# Altium project LAD_Power.PrjPcb
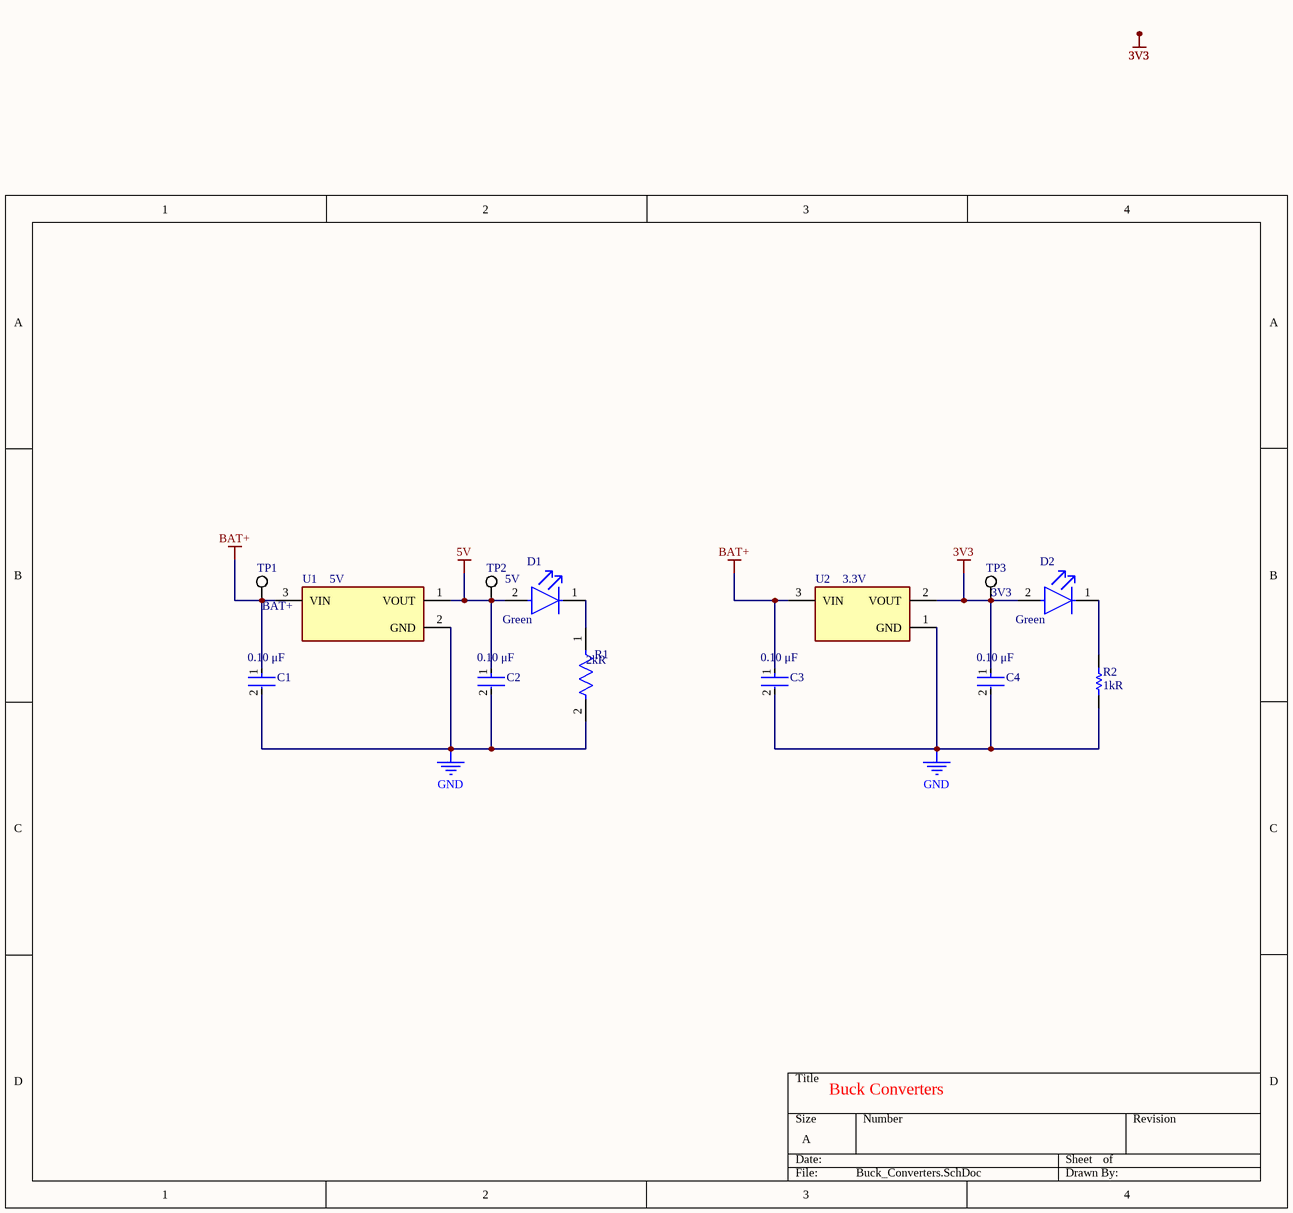
[diagram p0: Buck_Converters.SchDoc]
3 sheets, 15 parts. Net scope: global (net labels, ports and power ports of the same name join across sheets).
Board file: PCB1.PcbDoc
Sheets:
  Buck_Converters.SchDoc
  Connectors.SchDoc
  Power_Supply_no_IC.SchDoc

## Sheet Buck_Converters.SchDoc
size A; SheetNumber: 1; SheetTotal: 3

### Parts
C1  Capacitance: 0.10 μF  [FP-C0603C-CF-MFG]  (hidden comment: C0603C104K5RACTU)
C2  Capacitance: 0.10 μF  [FP-C0603C-CF-MFG]  (hidden comment: C0603C104K5RACTU)
C3  Capacitance: 0.10 μF  [FP-C0603C-CF-MFG]  (hidden comment: C0603C104K5RACTU)
C4  Capacitance: 0.10 μF  [FP-C0603C-CF-MFG]  (hidden comment: C0603C104K5RACTU)
D1  Color: Green  [FP-LTST-C190GKT-MFG]  (hidden comment: LTST-C190GKT)
D2  Color: Green  [FP-LTST-C190GKT-MFG]  (hidden comment: LTST-C190GKT)
R1  Resistance: 2kR  [FP-RG2012-IPC_A]  (hidden comment: RG2012P-202-B-T5)
R2  value 1kR  [RESC1608X55X25ML10T15]  (hidden comment: RT0603BRE071KL)
TP1  BAT+  [KSTN-5019_V]
TP2  5V  [KSTN-5019_V]
TP3  3V3  [KSTN-5019_V]
U1  Output Voltage: 5V  [FP-SOT-89-7098166-MFG]  (hidden comment: L78L05ACUTR)
U2  Output Voltage: 3.3V  [FP-SOT23-MFG]  (hidden comment: AP2120N-3.3TRG1)

### Nets
3V3: C4.1 D2.2(A) TP3.1 U2.2(VOUT)
5V: C2.1 D1.2(A) TP2.1 U1.1(VOUT)
BAT+: C1.1 C1.2 C2.2 C3.1 C3.2 C4.2 R1.2 R2.1 TP1.1 U1.2(GND) U1.3(VIN) U2.1(GND) U2.3(VIN)  [also labelled GND]
NetD1_1: D1.1(C) R1.1
NetD2_1: D2.1(C) R2.2

### Notes on the sheet
- Buck Converters

### Library data of the parts
C1-C4 = CMP-2006-03061-2: CAP CER 0.1UF 50V X7R 0603; Manufacturer: KEMET; Tolerance: 0.1; Temperature Coefficient: 30ppm/°C; Material: Ceramic; Automotive Grade: Grade 1; Value: 0.10 μF; Multilayer: Yes; Tolerance  (fill in as +-): 10%; Temperature: -55°C to +125°C; RoHS: TRUE; Temperature Range High: +125°C; Lead Free: Yes; Octopart: https://octopart.com/c0603c104k5ractu-kemet-139244; Digikey Description: CAP CER 0.1UF 50V X7R 0603; Category: Cap; Package: C0603C-CF; ComponentLink2Description: Datasheet; Temperature Range Low: -55°C; Device Class L1: Passive Components; Voltage Rating: 50 V; Automotive: Yes; Device Class L3: Ceramic Capacitors; ComponentLink2URL: https://api.kemet.com/component-edge/download/datasheet/C0603C100J5GACAUTO.pdf; Device Class L2: Capacitors; Manufacturer Part Number: C0603C104K5RACTU; Temperature Characteristic: X7R; Height: 0.87mm; Supplier: Digikey; Supplier Part Number: 399-C0603C104K5RAC7867CT-ND; Stock: 4063890; Pricing: 1=0.11, 10=0.074, 50=0.0424, 100=0.0329, 500=0.02474, 1000=0.01944 (USD); Mounting Technology: Surface Mount; Pins: 2; Dielectric Material: Ceramic; Package Shape: Rectangular; Case/Package: 0603; Terminal Finish: Nickel; Min Operating Temperature: -55°C; Max Operating Temperature: 125°C; JESD-609 Code: e3; Capacitor Type: Ceramic; Package Style: SMTMeter; Packaging: Tape and Reel; Tolerance (fill in as +-): 10%; Rated DC Voltage (URdc): 50V; Temperature Characteristics Code: X7R; Termination: Wraparound; Length: 1.6mm; Width: 0.8mm; Reach SVHC Compliant: Yes; RoHS Compliant: Yes; ComponentLink1URL: https://datasheet.ciiva.com:443/pdfs/VipMasterIC/IC/KEME/KEME-S-A0008991654/KEME-S-A0008991654-1.pdf?src-supplier=IHS+Markit; ComponentLink1Description: https://datasheet.ciiva.com:443/pdfs/VipMasterIC/IC/KEME/KEME-S-A0008991654/KEME-S-A0008991654-1.pdf?src-supplier=IHS+Markit
D1 D2 = CMP-22017-000005-2: LED GREEN CLEAR CHIP SMD; Manufacturer: Vishay Lite-On; Dominant Wavelength: 569nm; Reverse Voltage: 5V; Lens Color: Colorless; Viewing Angle: 130°; Voltage: 2V; Forward Current: 30mA; Power Dissipation: 100mW; Luminous Intensity: 6mcd; Number of LEDs: 1; Forward Voltage: 2.1V; Wavelength: 565nm; Test Current: 10mA; Shape: Rectangular; Optoelectronic Device Type: SINGLE COLOR LED; Overall Height: 0.8mm; Min Operating Temperature: -55°C; Lens Style: Clear; Mount: Surface Mount; Width: 0.8mm; Packaging: Tape and Reel; Lens Transparency: Clear; Case Code (Metric): 1608; Depth: 0.8mm; Case Code (Imperial): 0603; Case/Package: 0603; Number of Pins: 2; Max Operating Temperature: 85°C; Lead Free: Lead Free; Number of Elements: 1; Length: 1.6mm; Height: 0.8mm; Package Quantity: 1; Power Rating: 100mW; Radiation Hardening: No; Illumination Color: Green; Supplier: Digikey; Supplier Part Number: 160-1183-1-ND; Manufacturer Part Number: LTST-C190GKT; RoHS: Yes; Category: LEDs; Stock: 1403639; Pricing: 1=0.24, 10=0.133, 100=0.0617, 500=0.05696, 1000=0.04462, 2000=0.04367 (USD); Mounting Technology: Surface Mount; Pins: 2; Color@wavelength: Green; Terminal Finish: Tin; Luminous Intensity-Nom: 6mcd; Channels: 1; Reverse Voltage-Max: 5V; JESD-609 Code: e3; Size: 1.1mm; Terminal Pitch: 1.5mm; Reach SVHC Compliant: Yes; RoHS Compliant: Yes; ComponentLink1URL: https://datasheet.ciiva.com:443/pdfs/VipMasterIC/IC/LITE/LITES10869/LITES10869-1.pdf?src-supplier=IHS+Markit; ComponentLink1Description: https://datasheet.ciiva.com:443/pdfs/VipMasterIC/IC/LITE/LITES10869/LITES10869-1.pdf?src-supplier=IHS+Markit; ComponentLink2URL: https://datasheet.ciiva.com/2109/ltst-c190gkt-2109985.pdf?src-supplier=Digikey; ComponentLink2Description: https://datasheet.ciiva.com/2109/ltst-c190gkt-2109985.pdf?src-supplier=Digikey; ComponentLink3URL: https://datasheet.ciiva.com/11775/0900766b80dc02a6-11775616.pdf?src-supplier=Rs; ComponentLink3Description: https://datasheet.ciiva.com/11775/0900766b80dc02a6-11775616.pdf?src-supplier=Rs; ComponentLink4URL: https://datasheet.ciiva.com/12403/lite-on-ltst-c190gkt-187204-12403884.pdf?src-supplier=Mouser; ComponentLink4Description: https://datasheet.ciiva.com/12403/lite-on-ltst-c190gkt-187204-12403884.pdf?src-supplier=Mouser; ComponentLink5URL: https://datasheet.ciiva.com/16392/lite-on20ltst-c190gkt-16392818.pdf?src-supplier=Future+Electronics; ComponentLink5Description: https://datasheet.ciiva.com/16392/lite-on20ltst-c190gkt-16392818.pdf?src-supplier=Future+Electronics; ComponentLink6URL: https://datasheet.ciiva.com/2109/ltst-c190gkt-2109986.pdf?src-supplier=Digikey; ComponentLink6Description: https://datasheet.ciiva.com/2109/ltst-c190gkt-2109986.pdf?src-supplier=Digikey; ComponentLink7URL: https://datasheet.ciiva.com/2109/ltst-c190gkt-2109987.pdf?src-supplier=Digikey; ComponentLink7Description: https://datasheet.ciiva.com/2109/ltst-c190gkt-2109987.pdf?src-supplier=Digikey
R1 = CMP-2001-02825-2: Automotive Metal Thin Film Chip Resistor, 0805, 2kΩ, 0.1%, 25ppm/°C, 0.125W, 150V; Manufacturer: Susumu; Voltage Rating: 100V; Power Rating: 100mW; Max Power Dissipation: 125mW; Additional Feature: ANTI-SULFUR, PRECISION; Power: 250mW; Rated Temperature: 70°C; Value: 2kR; Package Height: 0.4mm; Package Length: 2mm; Package Width: 1.25mm; Reference Standard: AEC-Q200; Features: Automotive AEC-Q200; Voltage Rating (DC): 150V; Length: 2mm; Termination: SMD/SMT; Case Code (Imperial): 0805; Case/Package: 0805; Min Operating Temperature: -55°C; RoHS Compliant: Yes; Package Quantity: 5000; Height: 0.4mm; Case Code (Metric): 2012; Lead Free: Lead Free; Width: 1.25mm; Number of Terminations: 2; Max Operating Temperature: 155°C; Temperature Coefficient: 25ppm/°C; Size Code: 0805; Series: RG; Packaging: Tape and Reel; Tolerance: 0.1%; Supplier: Digikey; Supplier Part Number: RG20P2.0KBCT-ND; Manufacturer Part Number: RG2012P-202-B-T5; RoHS: Yes; Category: Chip SMD Resistors; Stock: 228903; Pricing: 1=0.2, 10=0.145, 50=0.1134, 100=0.1012, 500=0.07646, 1000=0.06737 (USD); Mounting Technology: Surface Mount; Pins: 2; Terminal Finish: Nickel; JESD-609 Code: e3; Resistor Type: FIXED RESISTOR; Construction: Rectangular; Package Style: SMTMeter; Technology: THIN FILM; Working Voltage: 150V; Reach SVHC Compliant: Yes; ComponentLink1URL: https://datasheet.ciiva.com:443/pdfs/VipMasterIC/IC/SUSU/SUSU-S-A0004582566/SUSU-S-A0004582566-1.pdf?src-supplier=IHS+Markit; ComponentLink1Description: https://datasheet.ciiva.com:443/pdfs/VipMasterIC/IC/SUSU/SUSU-S-A0004582566/SUSU-S-A0004582566-1.pdf?src-supplier=IHS+Markit; ComponentLink2URL: https://datasheet.ciiva.com/26874/getdatasheetpartid-485593-26874939.pdf?src-supplier=Verical; ComponentLink2Description: https://datasheet.ciiva.com/26874/getdatasheetpartid-485593-26874939.pdf?src-supplier=Verical
R2 = CMP-2000-04525-1: Manufacturer: Yageo; Tolerance: 0.1%; Power: 100mW; Temperature Coefficient: 50ppm/°C; Rated Temperature: 70°C; Working Voltage: 75V; Package Length: 1.6mm; Package Height: 0.45mm; Package Width: 0.8mm; Part Number: RT0603BRE071KL; Supplier: Digikey; Supplier Part Number: YAG2314CT-ND; Manufacturer Part Number: RT0603BRE071KL; RoHS: Yes; Category: Chip SMD Resistors; Stock: 31807; Pricing: 1=0.16, 10=0.12, 50=0.094, 100=0.084, 500=0.06376, 1000=0.05626 (USD); Mounting Technology: Surface Mount; Pins: 2; Case/Package: 0603; Min Operating Temperature: -55°C; Max Operating Temperature: 155°C; Resistor Type: FIXED RESISTOR; Packaging: Tape and Reel; Technology: THIN FILM; Construction: Chip; Package Style: SMTMeter; Termination: Wraparound; Reach SVHC Compliant: Yes; RoHS Compliant: Yes; ComponentLink1URL: https://datasheet.ciiva.com:443/pdfs/VipMasterIC/IC/YAGO/YAGO-S-A0008510989/YAGO-S-A0008510989-1.pdf?src-supplier=IHS+Markit; ComponentLink1Description: https://datasheet.ciiva.com:443/pdfs/VipMasterIC/IC/YAGO/YAGO-S-A0008510989/YAGO-S-A0008510989-1.pdf?src-supplier=IHS+Markit; ComponentLink2URL: https://datasheet.ciiva.com/2584/pyu-rt-1-to-0-05-rohs-l-5-2584317.pdf?src-supplier=Digikey; ComponentLink2Description: https://datasheet.ciiva.com/2584/pyu-rt-1-to-0-05-rohs-l-5-2584317.pdf?src-supplier=Digikey
TP1-TP3 = CMP-1672-00008-1: Test Point, 1 Position SMD, RoHS, Tape and Reel; Manufacturer: Keystone Electronics; Manufacturer Part Number: 5019; Description: Interconnection Device; ComponentLink1Description: Manufacturer URL; Package Quantity: 1000; DatasheetVersion: 03/2014; Packaging: Tape and Reel; ComponentLink2URL: http://www.keyelco.com/product-pdf.cfm?p=1357; ComponentLink1URL: http://www.keyelco.com/; Mount: Surface Mount; Contact Plating: Silver; PackageDescription: 1-Pin Surface Mount Device, Body 3.81 x 2.03 mm; Pins: 1; RoHSCompliant: True; Mounting Technology: Surface Mount; ComponentLink2Description: Datasheet; PackageReference: 5019; Supplier: Digikey; Supplier Part Number: 36-5019CT-ND; RoHS: Yes; Category: Connectors; Stock: 174520; Pricing: 1=0.34, 25=0.2736, 100=0.2234, 250=0.20064, 500=0.19152 (USD); Connector Type: Interconnection Device; Reach SVHC Compliant: Yes; RoHS Compliant: Yes; ComponentLink3URL: https://datasheet.ciiva.com:443/pdfs/VipMasterIC/IC/KEYC/KEYC-S-A0003063693/KEYC-S-A0003063693-1.pdf?src-supplier=IHS+Markit; ComponentLink3Description: https://datasheet.ciiva.com:443/pdfs/VipMasterIC/IC/KEYC/KEYC-S-A0003063693/KEYC-S-A0003063693-1.pdf?src-supplier=IHS+Markit; ComponentLink4URL: https://datasheet.ciiva.com/16318/m60-2p61-16318395.pdf?src-supplier=Future+Electronics; ComponentLink4Description: https://datasheet.ciiva.com/16318/m60-2p61-16318395.pdf?src-supplier=Future+Electronics; ComponentLink5URL: https://datasheet.ciiva.com/14848/m60-2p61-14848438.pdf?src-supplier=Digikey; ComponentLink5Description: https://datasheet.ciiva.com/14848/m60-2p61-14848438.pdf?src-supplier=Digikey; ComponentLink6URL: https://datasheet.ciiva.com/14848/m60-2p61-14848439.pdf?src-supplier=Digikey; ComponentLink6Description: https://datasheet.ciiva.com/14848/m60-2p61-14848439.pdf?src-supplier=Digikey; ComponentLink7URL: https://datasheet.ciiva.com/14848/m60-2p61-14848437.pdf?src-supplier=Digikey; ComponentLink7Description: https://datasheet.ciiva.com/14848/m60-2p61-14848437.pdf?src-supplier=Digikey; ComponentLink8URL: https://datasheet.ciiva.com/16885/70182998-16885945.pdf?src-supplier=Allied+Electronics; ComponentLink8Description: https://datasheet.ciiva.com/16885/70182998-16885945.pdf?src-supplier=Allied+Electronics
U1 = CMP-0244-00407-2: IC REG LINEAR 5V 100MA SOT89-3; Manufacturer: STMicroelectronics; Output Voltage Accuracy: 4%; Number of Regulators: 1; Polarity: Positive; Quiescent Current: 6mA; Min Input Voltage: 7V; Power Supply Rejection Ratio (PSRR): 49dB; Output Type: Fixed; Max Input Voltage: 30V; Dropout Voltage: 1.7V; Package Body Material: Plastic; Max Supply Voltage: 20V; Line Regulation-Max: 0.15%; Load Regulation-Max: 0.06%; Output Current1-Max: 70mA; Output Voltage1-Max: 5.25V; Output Voltage1-Min: 4.75V; Package Equivalence Code: TO-243; Regulator Type: FIXED POSITIVE SINGLE OUTPUT STANDARD REGULATOR; Time @ Peak Reflow Temperature-Max (s): 30s; Voltage Tolerance-Max: 5%; Qualification Status: Not Qualified; Nominal Output Voltage: 5V; Radiation Hardening: No; Number of Pins: 3; Weight: 0.004603oz; Output Current: 100mA; Width: 2.6mm; Packaging: Tape and Reel; Length: 4.6mm; Max Output Current: 100mA; Min Operating Temperature: 0°C; Package Quantity: 1; Accuracy: 4%; Case/Package: SOT-89; Lead Free: Lead Free; Height: 1.6mm; Min Output Voltage: 5V; Contact Plating: Tin; Number of Outputs: 1; REACH SVHC: No SVHC; Mount: Surface Mount; Max Operating Temperature: 125°C; Supplier: Digikey; Supplier Part Number: 497-1183-1-ND; Manufacturer Part Number: L78L05ACUTR; RoHS: Yes; Category: Voltage Regulators - Linear; Stock: 92237; Pricing: 1=0.54, 10=0.464, 25=0.4328, 100=0.3461, 250=0.32144, 500=0.27198, 1000=0.21016 (USD); Pins: 3; Package Shape: Rectangular; Terminal Finish: Tin; JESD-609 Code: e3; Adjustability: FIXED; Dropout Voltage1-Nom: 1.7V; Input Voltage Absolute-Max: 30V; JESD-30 Code: R-PSSO-F3; Moisture Sensitivity Level: 1; Channels: 1; Operating Temperature, TJ-Max: 125°C; Operating Temperature, TJ-Min: 0°C; Output Voltage1-Nom: 5V; Package Style: SMALL OUTLINEMeter; Peak Reflow Temperature (Cel): 260°C; Surface Mount: Yes; Technology: BIPOLAR; Terminal Form: Flat; Terminal Position: SINGLE; Height - Seated (Max): 1.6mm; Terminal Pitch: 1.495mm; Reach SVHC Compliant: Yes; RoHS Compliant: Yes; ComponentLink1URL: https://datasheet.ciiva.com:443/pdfs/VipMasterIC/IC/SGST/SGST-S-A0002857926/SGST-S-A0002857926-1.pdf?src-supplier=IHS+Markit; ComponentLink1Description: https://datasheet.ciiva.com:443/pdfs/VipMasterIC/IC/SGST/SGST-S-A0002857926/SGST-S-A0002857926-1.pdf?src-supplier=IHS+Markit; ComponentLink2URL: https://datasheet.ciiva.com/1511/1868798-1511940.pdf?src-supplier=Element14; ComponentLink2Description: https://datasheet.ciiva.com/1511/1868798-1511940.pdf?src-supplier=Element14; ComponentLink3URL: https://datasheet.ciiva.com/22710/1868798-22710940.pdf?src-supplier=Element14; ComponentLink3Description: https://datasheet.ciiva.com/22710/1868798-22710940.pdf?src-supplier=Element14; ComponentLink4URL: https://datasheet.ciiva.com/7992/1868798-7992600.pdf?src-supplier=Element14; ComponentLink4Description: https://datasheet.ciiva.com/7992/1868798-7992600.pdf?src-supplier=Element14; ComponentLink5URL: https://datasheet.ciiva.com/2041/cd00000446-2041791.pdf?src-supplier=Digikey; ComponentLink5Description: https://datasheet.ciiva.com/2041/cd00000446-2041791.pdf?src-supplier=Digikey; ComponentLink6URL: https://datasheet.ciiva.com/2041/cd00000446-2041790.pdf?src-supplier=Digikey; ComponentLink6Description: https://datasheet.ciiva.com/2041/cd00000446-2041790.pdf?src-supplier=Digikey; ComponentLink7URL: https://datasheet.ciiva.com/2041/cd00000446-2041792.pdf?src-supplier=Digikey; ComponentLink7Description: https://datasheet.ciiva.com/2041/cd00000446-2041792.pdf?src-supplier=Digikey; ComponentLink8URL: https://datasheet.ciiva.com/4882/cd00000446-355303-4882429.pdf?src-supplier=Mouser; ComponentLink8Description: https://datasheet.ciiva.com/4882/cd00000446-355303-4882429.pdf?src-supplier=Mouser; ComponentLink9URL: https://datasheet.ciiva.com/16393/cd00000446-16393708.pdf?src-supplier=Future+Electronics; ComponentLink9Description: https://datasheet.ciiva.com/16393/cd00000446-16393708.pdf?src-supplier=Future+Electronics
U2 = CMP-12756-000008-1: IC REG LINEAR 3.3V 150MA SOT23; Manufacturer: Diodes Inc.; Min Supply Voltage: 2V; Standoff Height: 0.013mm; Max Junction Temp: +85°C; Output Type: Fixed; Max Supply Voltage: 6V; Accuracy Percentage: 2%; Nominal Supply Current: 25uA; Dropout Voltage: 300mV; Number Of Outputs: 1; Package Body Material: Plastic; Input Voltage Absolute-Max: 6.5V; Line Regulation-Max: 0.016%; Load Regulation-Max: 0.04%; Output Current1-Max: 100mA; Output Voltage1-Max: 3.366V; Output Voltage1-Min: 3.234V; Package Equivalence Code: TO-236; Regulator Type: FIXED POSITIVE SINGLE OUTPUT LDO REGULATOR; Time @ Peak Reflow Temperature-Max (s): 30s; Qualification Status: Not Qualified; Footprint Url: https://www.diodes.com/assets/Package-Files/SOT23.pdf; Category: IC; Manufacturer Part Number: AP2120N-3.3TRG1; ComponentLink2Description: Datasheet; Device Class L1: Integrated Circuits (ICs); Octopart: https://octopart.com/ap2120n-3.3trg1-diodes+inc.-30954573; Temperature Range Low: -40°C; Temperature: -40°C to +85°C; Temperature Range High: +85°C; Package: SOT23; Digikey Description: IC REG LINEAR 3.3V 150MA SOT23; Height: 1.1mm; Mouser Description: AP2120 Series 3.3 V 0.15 A Surface Mount CMOS LDO Regulator - SOT23; RoHS: TRUE; ComponentLink2URL: https://www.diodes.com/assets/Package-Files/SOT23.pdf; Device Class L2: Power Management ICs; Device Class L3: Voltage Regulators - Linear; Output Current: 150mA; Ipc Land Pattern Name: SOT92P240X102-3; Lead Free: Yes; Automotive: No; Supplier: Digikey; Supplier Part Number: AP2120N-3.3TRG1DICT-ND; Stock: 949628; Pricing: 1=0.38, 10=0.281, 25=0.246, 100=0.1592, 250=0.1318, 500=0.10544, 1000=0.08084 (USD); Case/Package: TSSOP; Pins: 3; Package Shape: Rectangular; Terminal Finish: Tin; JESD-609 Code: e3; JESD-30 Code: R-PDSO-G3; Package Style: SMALL OUTLINE, THIN PROFILE, SHRINK PITCHMeter; Surface Mount: Yes; Technology: CMOS; Terminal Form: Gull Wing; Terminal Position: DUAL; Adjustability: FIXED; Dropout Voltage1-Max: 300mV; Dropout Voltage1-Nom: 300mV; Min Input Voltage: 2V; Moisture Sensitivity Level: 3; Channels: 1; Operating Temperature, TJ-Max: 85°C; Operating Temperature, TJ-Min: -40°C; Output Voltage1-Nom: 3.3V; Packaging: Tape and Reel; Peak Reflow Temperature (Cel): 260°C; Voltage Tolerance-Max: 2%; Length: 2.9mm; Width: 1.3mm; Height - Seated (Max): 1.2mm; Terminal Pitch: 0.95mm; Reach SVHC Compliant: Yes; RoHS Compliant: Yes; ComponentLink1URL: https://datasheet.ciiva.com:443/pdfs/VipMasterIC/IC/DIOD/DIOD-S-A0008513436/DIOD-S-A0008513436-1.pdf?src-supplier=IHS+Markit; ComponentLink1Description: https://datasheet.ciiva.com:443/pdfs/VipMasterIC/IC/DIOD/DIOD-S-A0008513436/DIOD-S-A0008513436-1.pdf?src-supplier=IHS+Markit; ComponentLink3URL: https://datasheet.ciiva.com/29569/ap2120-29569979.pdf?src-supplier=Digikey; ComponentLink3Description: https://datasheet.ciiva.com/29569/ap2120-29569979.pdf?src-supplier=Digikey; ComponentLink4URL: https://datasheet.ciiva.com/29569/ap2120-29569977.pdf?src-supplier=Digikey; ComponentLink4Description: https://datasheet.ciiva.com/29569/ap2120-29569977.pdf?src-supplier=Digikey; ComponentLink5URL: https://datasheet.ciiva.com/30016/ap2120-30016809.pdf?src-supplier=Avnet; ComponentLink5Description: https://datasheet.ciiva.com/30016/ap2120-30016809.pdf?src-supplier=Avnet; ComponentLink6URL: https://datasheet.ciiva.com/29569/ap2120-29569978.pdf?src-supplier=Digikey; ComponentLink6Description: https://datasheet.ciiva.com/29569/ap2120-29569978.pdf?src-supplier=Digikey

## Sheet Connectors.SchDoc
size A; SheetNumber: 2; SheetTotal: 3
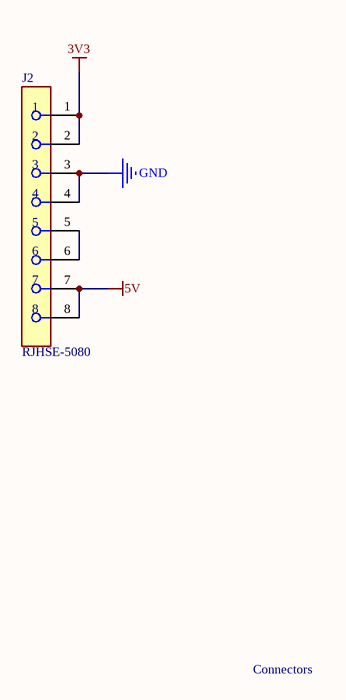
[diagram p1: Connectors.SchDoc]

### Parts
J2  RJHSE-5080  [FP-RJHSE-5080-MFG]

### Nets
3V3: J2.1 J2.2
5V: J2.7 J2.8
GND: J2.3 J2.4  [project net BAT+]
NetJ2_5: J2.5 J2.6

### Notes on the sheet
- Connectors

### Library data of the parts
J2 = CMP-02366-000003-1: CONN MOD JACK 8P8C R/A UNSHLD; Manufacturer: Amphenol; Current Rating: 1.5A; Voltage Rating: 125V; Pitch: 1.02mm; Conn Orientation: Right Angle; Number Of Contacts: 8; Is Female: yes; Conn Gender: Female; Connector Type: TELECOM AND DATACOM CONNECTOR; Contact Style: TELCOM, MODULAR; Number of Ports: 1; PCB Contact Pattern: STAGGERED; Option: General Purpose; Empty Shell: No; Body Breadth: 0.52inch; Body Depth: 0.59inch; Body Length: 0.62inch; Mounting Option 1: LOCKING; Plating Thickness: 50uin; Reference Standard: UL; Reliability: COMMERCIAL; Lead Free: Yes; Device Class L3: unset; Footprint Url: https://cdn.amphenol-icc.com/media/wysiwyg/files/drawing/rjhse5080.pdf?__cf_chl_jschl_tk__=e349db0bbbb6188a39347cd5e541b92fa02c9719-1587748343-0-AW7tChdeHzRPLX9gSWj7WrKaXQoY9BsmT9Ek0h-T62M9y3Rs9iypFcOtkzb-6sGYQEjFE-jcoNciDETCOZrh1rYyOesac5SvYLoLwHIsHvF4AKBlx-MXmfZUVk9OTTJLqyQq2qMm0PFRLJpNcK0nrKResqOniRSYixG2sPTmOPraH-ULJFBDL602CHqcI9KKBgTq90Jh1OL2Td4moJ99rFsJRJ1Tk_uoxGe8ublcP_ARu-uLpWcQrBcwOcHDTAwL29DAwVaqcH7ta8Ks7WMlHmVl_pILeEDwT0bE9vu5Pa5S3PtNRF1leuFkgi_FMbUxTDulc5xzbXSfng8srUIV1lWXny5nx1fZJEUa_w97yKjffzBMxiWLWVN-V7-uqAaPbyv_m-wRyw5O25OZNyJOeGU; ComponentLink2URL: https://cdn.amphenol-icc.com/media/wysiwyg/files/documentation/datasheet/inputoutput/io-modjack-rjhse.pdf; Device Class L1: Connectors; Package: CONN_MOD_JACK; Mouser Description: Modular Connectors / Ethernet Connectors R/A RJ45 NONSHIELDED 8 CONT NO LEDS; Manufacturer Part Number: RJHSE-5080; Octopart: https://octopart.com/rjhse-5080-amphenol-45060; Category: Conn; Height: 0.535inch; Temperature: -55°C to +85°C; Digikey Description: CONN MOD JACK 8P8C R/A UNSHLD; Device Class L2: Modular / Ethernet Connectors; Contact Material: Gold,Nickel; ComponentLink2Description: Datasheet; Temperature Range Low: -55°C; RoHS: TRUE; Automotive: No; Temperature Range High: +85°C; Supplier: Digikey; Supplier Part Number: RJHSE-5080-ND; Stock: 69947; Pricing: 1=1.03, 10=0.867, 36=0.83194, 72=0.81417, 108=0.7788, 252=0.70802, 504=0.6372, 1008=0.56641, 2520=0.51331 (USD); Mounting Technology: Panel,Board; Contact Finish - Mating: GOLD (50) OVER NICKEL (50); Contact Finish - Termination: Matte Tin (Sn); Insulation Color: Black; Insulation Material: Thermoplastic; Shell Material: Polyethylene; JESD-609 Code: e3; Body/Shell Style: JACK; Contact Gender: Female; Mounting Style: RIGHT ANGLE; Termination: Solder; Filter Feature: No; Mixed Contacts: No; Terminal Length: 0.1inch; Terminal Pitch: 2.032mm; Flammability Rating: UL94 V-0; Reach SVHC Compliant: Yes; RoHS Compliant: Yes; DIN Conformance: No; IEC Conformance: No; MIL Conformance: No; ComponentLink1URL: https://datasheet.ciiva.com:443/pdfs/VipMasterIC/IC/AMPH/AMPH-S-A0001396201/AMPH-S-A0001290431-1.pdf?src-supplier=IHS+Markit; ComponentLink1Description: https://datasheet.ciiva.com:443/pdfs/VipMasterIC/IC/AMPH/AMPH-S-A0001396201/AMPH-S-A0001290431-1.pdf?src-supplier=IHS+Markit; ComponentLink3URL: https://datasheet.ciiva.com/685/rjhse5080-685586.pdf?src-supplier=Digikey; ComponentLink3Description: https://datasheet.ciiva.com/685/rjhse5080-685586.pdf?src-supplier=Digikey; ComponentLink4URL: https://datasheet.ciiva.com/7629/1682821-7629402.pdf?src-supplier=Element14; ComponentLink4Description: https://datasheet.ciiva.com/7629/1682821-7629402.pdf?src-supplier=Element14; ComponentLink5URL: https://datasheet.ciiva.com/15171/getdatasheetpartid-643190-15171163.pdf?src-supplier=Verical; ComponentLink5Description: https://datasheet.ciiva.com/15171/getdatasheetpartid-643190-15171163.pdf?src-supplier=Verical; ComponentLink6URL: https://datasheet.ciiva.com/1432/1693748-1432448.pdf?src-supplier=Element14; ComponentLink6Description: https://datasheet.ciiva.com/1432/1693748-1432448.pdf?src-supplier=Element14

## Sheet Power_Supply_no_IC.SchDoc
size A; SheetNumber: 3; SheetTotal: 3
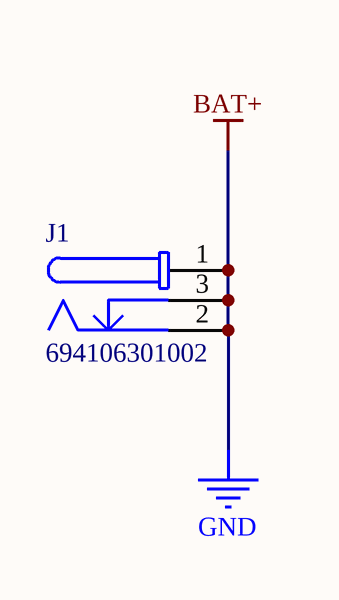
[diagram p2: Power_Supply_no_IC.SchDoc]

### Parts
J1  694106301002  [694106301002]

### Nets
BAT+: J1.1 J1.2 J1.3  [also labelled GND]

### Library data of the parts
J1 = CMP-1502-00188-2: NexarPartId: 52676100; Manufacturer: Wurth Electronics; Voltage Rating (DC): 20V; Gender: Male; Voltage Rating: 24V; Connector Type: Power; Insulation Resistance: 100MΩ; Current Rating: 5A; Shielding: Unshielded; Number of Contacts: 3; Color: Black; Housing Material: Polyamide; Contact Gender: Female; REACH SVHC: Unknown; Termination: Through Hole; Height: 11mm; RoHS: Compliant; Mount: Through Hole; Flammability Rating: UL94 V-0; Packaging: Bulk; Min Operating Temperature: -40°C; Contact Plating: Tin; Max Operating Temperature: 85°C; Operating Supply Voltage: 24V; Contact Material: Gold, Tin; Supplier: Digikey; Supplier Part Number: 732-5930-ND; Manufacturer Part Number: 694106301002; Category: Power Connectors; Stock: 12798; Pricing: 1=1.02, 10=0.97, 50=0.86, 100=0.8, 500=0.69, 1000=0.59 (USD); Contact Finish - Mating: NOT SPECIFIED; Reach SVHC Compliant: Yes; RoHS Compliant: Yes; ComponentLink1URL: https://datasheet.ciiva.com:443/pdfs/VipMasterIC/IC/MIDC/MIDC-S-A0001192814/MIDC-S-A0001192814-1.pdf?src-supplier=IHS+Markit; ComponentLink1Description: https://datasheet.ciiva.com:443/pdfs/VipMasterIC/IC/MIDC/MIDC-S-A0001192814/MIDC-S-A0001192814-1.pdf?src-supplier=IHS+Markit; ComponentLink2URL: http://www.mouser.com/ds/2/445/6941xx301002-469315.pdf?src-supplier=Mouser; ComponentLink2Description: http://www.mouser.com/ds/2/445/6941xx301002-469315.pdf?src-supplier=Mouser; ComponentLink3URL: http://www.farnell.com/cad/2130967.pdf?src-supplier=Element14; ComponentLink3Description: http://www.farnell.com/cad/2130967.pdf?src-supplier=Element14; ComponentLink4URL: https://katalog.we-online.de/em/datasheet/6941xx301002.pdf?src-supplier=Digikey; ComponentLink4Description: https://katalog.we-online.de/em/datasheet/6941xx301002.pdf?src-supplier=Digikey

## Nets that join several sheets
3V3: Buck_Converters (C4.1 D2.2 TP3.1 U2.2), Connectors (J2.1 J2.2)
5V: Buck_Converters (C2.1 D1.2 TP2.1 U1.1), Connectors (J2.7 J2.8)
BAT+: Buck_Converters (13 pins), Connectors (J2.3 J2.4), Power_Supply_no_IC (J1.1 J1.2 J1.3)